# Altium project Encoder_Board.PrjPcb
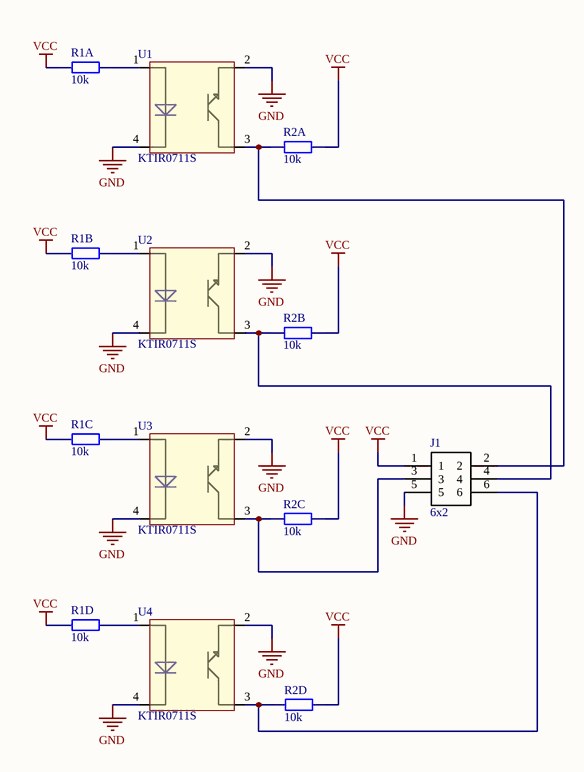
[diagram p0: Encoder_Baord.SchDoc]
1 sheet, 7 parts. Net scope: global (net labels, ports and power ports of the same name join across sheets).
Board file: Encoder_Board.PcbDoc

## Sheet Encoder_Baord.SchDoc
size A4; Organization: Altium Limited; Address1: L3, 12a Rodborough Rd; Address2: Frenchs Forest; Address3: NSW; Address4: Australia 2086

### Parts
J1  6x2  [Goldpin 2.00mm pin 2X3 angle]
R1  10k  [1206_4R]  (parts A,B,C,D of 4)
R2  10k  [1206_4R]  (parts A,B,C,D of 4)
U1  KTIR0711S  [KTIR0711S]
U2  KTIR0711S  [KTIR0711S]
U3  KTIR0711S  [KTIR0711S]
U4  KTIR0711S  [KTIR0711S]

### Nets
GND: J1.5 U1.2 U1.4 U2.2 U2.4 U3.2 U3.4 U4.2 U4.4
VCC: J1.1 R1.1 R1.2 R1.3 R1.4 R2.1 R2.2 R2.3 R2.4
NetJ1_2: J1.2 R2.8 U1.3
NetJ1_3: J1.3 R2.6 U3.3
NetJ1_4: J1.4 R2.7 U2.3
NetJ1_6: J1.6 R2.5 U4.3
NetR1_5: R1.5 U4.1
NetR1_6: R1.6 U3.1
NetR1_7: R1.7 U2.1
NetR1_8: R1.8 U1.1

### Notes on the sheet
- Title
- Size:
- Date:
- A4
- Number:
- Time:
- Revision:
- Sheet
- of
- File:

### Library data of the parts
J1 = Header 2mm 6-way: Goldpin 2mmm angle
R1 R2 = R_4R_MP: Resistor Pack, Multi part
U1-U4 = KTIR0711S: KTIR0711S photointerrupter; Supplier: TME; URL: https://www.tme.eu/pl/details/ktir0711s/czujniki-fotoelektryczne-do-druku/kingbright-electronic/